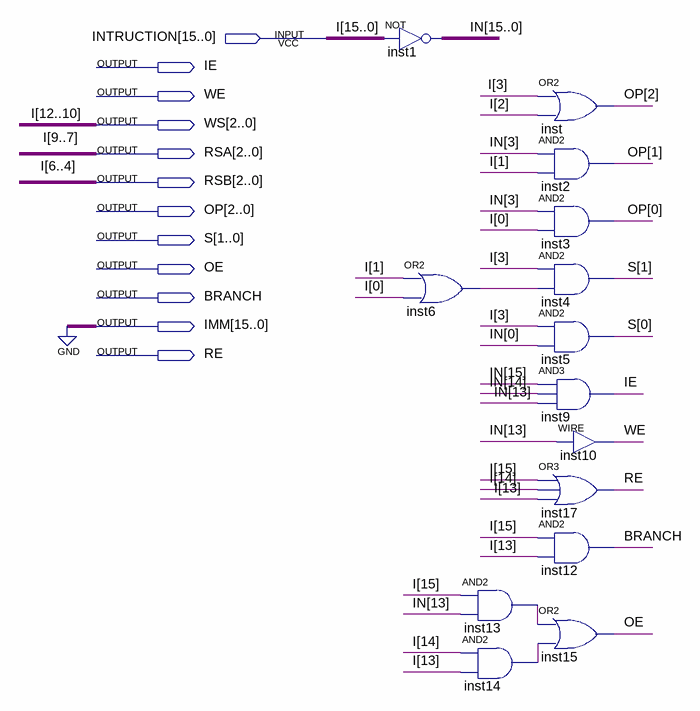
[diagram p0: schematic sheet]
// Quartus schematic INTRUCDECOER.bdf as structural Verilog: 14 symbols, 12 pins
module INTRUCDECOER (
  input  [15:0] INTRUCTION,
  output IE,
  output WE,
  output [2:0] WS,
  output [2:0] RSA,
  output [2:0] RSB,
  output [2:0] OP,
  output [1:0] S,
  output OE,
  output BRANCH,
  output [15:0] IMM,
  output RE
);

  wire inst6_out, inst13_out, inst14_out;
  wire [15:0] IN;

  assign IN = ~INTRUCTION;  // NOT inst1, 16 bits wide
  or inst6 (inst6_out, INTRUCTION[1], INTRUCTION[0]);
  and inst13 (inst13_out, INTRUCTION[15], IN[13]);
  and inst14 (inst14_out, INTRUCTION[14], INTRUCTION[13]);
  or inst (OP[2], INTRUCTION[3], INTRUCTION[2]);
  and inst2 (OP[1], IN[3], INTRUCTION[1]);
  and inst3 (OP[0], IN[3], INTRUCTION[0]);
  and inst4 (S[1], INTRUCTION[3], inst6_out);
  and inst5 (S[0], INTRUCTION[3], IN[0]);
  and inst9 (IE, IN[15], IN[14], IN[13]);
  assign WE = IN[13];  // WIRE inst10
  or inst17 (RE, INTRUCTION[15], INTRUCTION[14], INTRUCTION[13]);
  and inst12 (BRANCH, INTRUCTION[15], INTRUCTION[13]);
  or inst15 (OE, inst13_out, inst14_out);

  assign IMM = {16{1'b0}};
  assign RSA = INTRUCTION[9:7];
  assign RSB = INTRUCTION[6:4];
  assign WS = INTRUCTION[12:10];

  // Other names for the same wires on the sheet: I[15:0] = INTRUCTION
endmodule
